# Altium project S6.PrjPCB
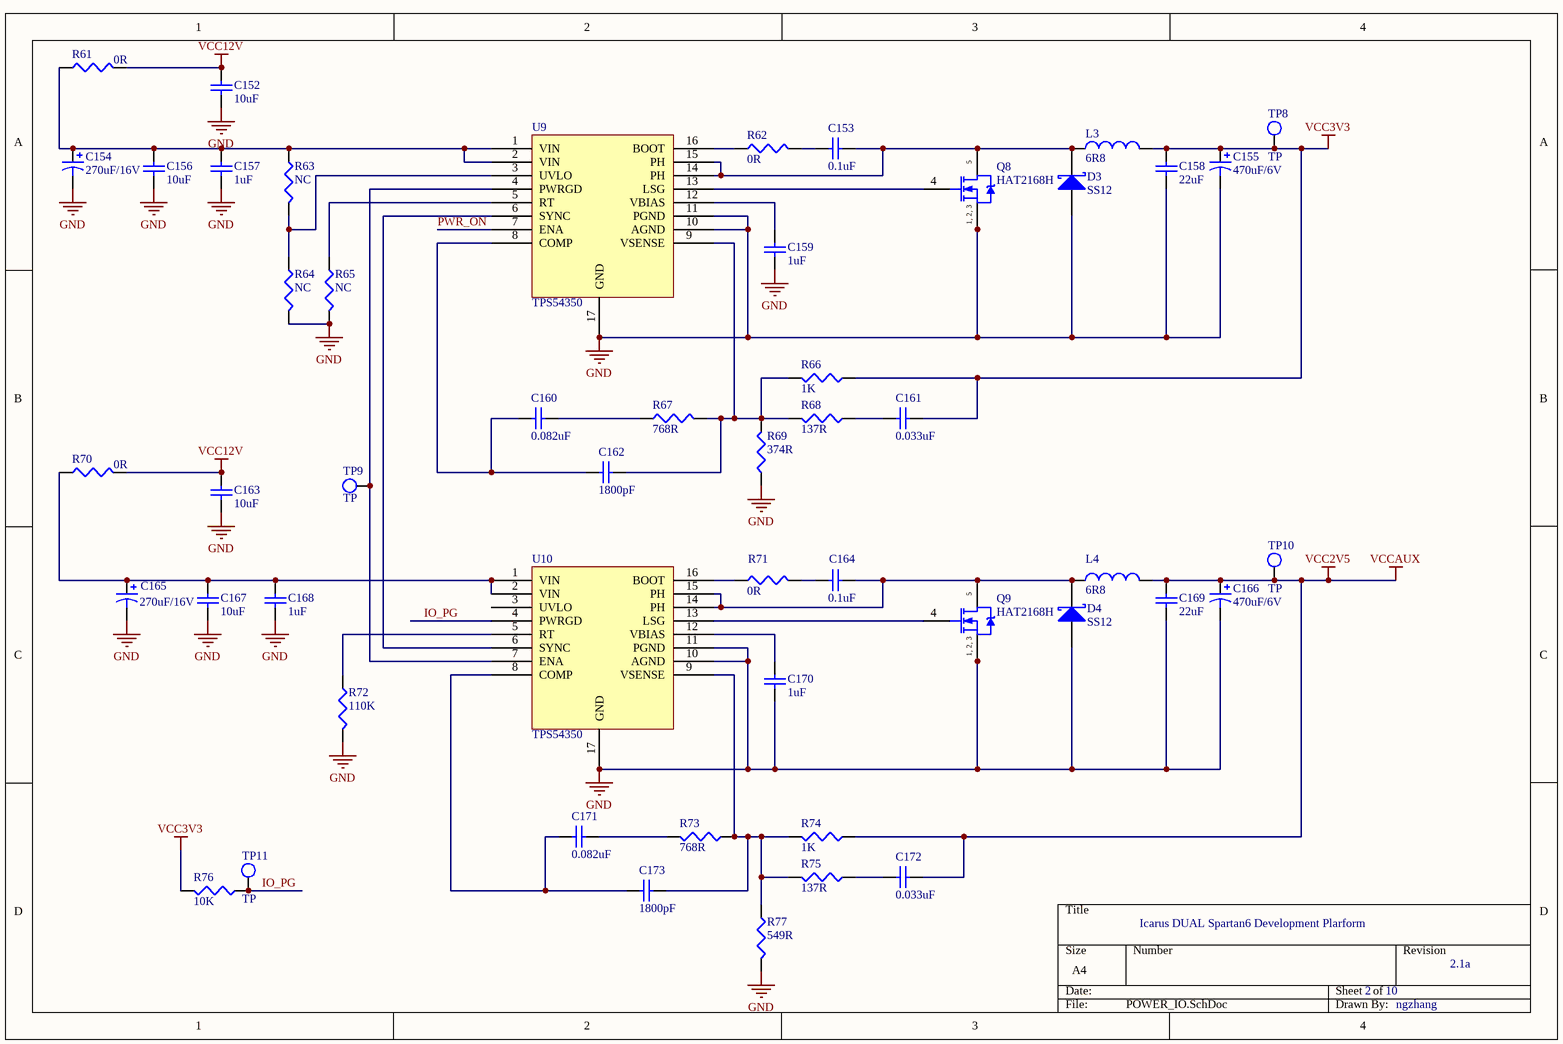
[diagram p0: POWER_IO.SchDoc]
4 sheets, 190 parts. Net scope: global (net labels, ports and power ports of the same name join across sheets).
Board file: S6.PcbDoc
Sheets:
  POWER_IO.SchDoc
  POWER.SchDoc
  USB2UART.SchDoc
  CONFIG.SchDoc

## Sheet POWER_IO.SchDoc
size A4

### Parts
C152  10uF  [C1206]
C153  0.1uF  [1608[0603]]
C154  270uF/16V  [CAP8X8]
C155  470uF/6V  [CAP8X8]
C156  10uF  [C1206]
C157  1uF  [1608[0603]]
C158  22uF  [C1206]
C159  1uF  [1608[0603]]
C160  0.082uF  [1608[0603]]
C161  0.033uF  [1608[0603]]
C162  1800pF  [1608[0603]]
C163  10uF  [C1206]
C164  0.1uF  [1608[0603]]
C165  270uF/16V  [CAP8X8]
C166  470uF/6V  [CAP8X8]
C167  10uF  [C1206]
C168  1uF  [1608[0603]]
C169  22uF  [C1206]
C170  1uF  [1608[0603]]
C171  0.082uF  [1608[0603]]
C172  0.033uF  [1608[0603]]
C173  1800pF  [1608[0603]]
D3  SS12  [SMA]
D4  SS12  [SMA]
L3  value 6R8  [IHLP4040]  (hidden comment: IHLP4040DZ11)
L4  value 6R8  [IHLP4040]  (hidden comment: IHLP4040DZ11)
Q8  HAT2168H  [LFPAK]
Q9  HAT2168H  [LFPAK]
R61  0R  [C1206]
R62  0R  [J1-0603]
R63  NC  [J1-0603]
R64  NC  [J1-0603]
R65  NC  [J1-0603]
R66  1K  [J1-0603]
R67  768R  [J1-0603]
R68  137R  [J1-0603]
R69  374R  [J1-0603]
R70  0R  [C1206]
R71  0R  [J1-0603]
R72  110K  [J1-0603]
R73  768R  [J1-0603]
R74  1K  [J1-0603]
R75  137R  [J1-0603]
R76  10K  [J1-0603]
R77  549R  [J1-0603]
TP8  TP  [TP]
TP9  TP  [TP]
TP10  TP  [TP]
TP11  TP  [TP]
U9  TPS54350  [TSSOP16_PP]
U10  TPS54350  [TSSOP16_PP]

### Nets
GND: C152.1 C154.2 C155.2 C156.1 C157.1 C158.1 C159.1 C163.1 C165.2 C166.2 C167.1 C168.1 C169.1 C170.2 D3.1(A) D4.1(A) Q8.1(S) Q8.2(S) Q8.3(S) Q9.1(S) Q9.2(S) Q9.3(S) R64.2 R65.2 R69.1 R72.2 R77.2 U9.10(AGND) U9.11(PGND) U9.17(GND) U10.10(AGND) U10.11(PGND) U10.17(GND)
VCC2V5: C166.1 C169.2 C172.2 L4.2 R74.1 TP10.1(TP)  [also labelled VCCAUX]  [project net VREF]
VCC3V3: C155.1 C158.2 C161.2 L3.2 R66.1 R76.2 TP8.1(TP)
VCC12V: C152.2 C163.2 R61.2 R70.2
IO_PG: R76.1 TP11.1(TP) U10.4(PWRGD)
PWR_ON: U9.7(ENA)
NetC153_1: C153.1 R62.2
NetC153_2: C153.2 D3.2(K) L3.1 Q8.5(D) U9.14(PH) U9.15(PH)
NetC154_1: C154.1 C156.2 C157.2 R61.1 R63.1 U9.1(VIN) U9.2(VIN)
NetC159_2: C159.2 U9.12(VBIAS)
NetC160_1: C160.1 C162.1 U9.8(COMP)
NetC160_2: C160.2 R67.1
NetC161_1: C161.1 R68.1
NetC162_2: C162.2 R66.2 R67.2 R68.2 R69.2 U9.9(VSENSE)
NetC164_1: C164.1 D4.2(K) L4.1 Q9.5(D) U10.14(PH) U10.15(PH)
NetC164_2: C164.2 R71.2
NetC165_1: C165.1 C167.2 C168.2 R70.1 U10.1(VIN) U10.2(VIN)
NetC170_1: C170.1 U10.12(VBIAS)
NetC171_1: C171.1 C173.1 U10.8(COMP)
NetC171_2: C171.2 R73.2
NetC172_1: C172.1 R75.1
NetC173_2: C173.2 R73.1 R74.2 R75.2 R77.1 U10.9(VSENSE)
NetQ8_4: Q8.4(G) U9.13(LSG)
NetQ9_4: Q9.4(G) U10.13(LSG)
NetR62_1: R62.1 U9.16(BOOT)
NetR63_2: R63.2 R64.1 U9.3(UVLO)
NetR65_1: R65.1 U9.5(RT)
NetR71_1: R71.1 U10.16(BOOT)
NetR72_1: R72.1 U10.5(RT)
NetTP9_1: TP9.1(TP) U9.4(PWRGD) U10.7(ENA)
NetU9_6: U9.6(SYNC) U10.6(SYNC)

Not connected (* = marked no-connect by the designer): U10 3(UVLO)

### Notes on the sheet
- Icarus DUAL Spartan6 Development Plarform
- 2
- 10
- 2.1a
- ngzhang
- (in symbol HAT216X) 1, 2, 3

### Library data of the parts
C152 C153 C156-C164 C167-C173 = Cap Semi: Capacitor (Semiconductor SIM Model); Published: 8-Jun-2000; LatestRevisionDate: 29-May-2009; LatestRevisionNote: IPC-7351 Footprint Added.; PackageReference: C1206; Publisher: Altium Limited; PackageDescription: Chip Capacitor
  C152 C156 C163 C167: Value: 10uF
  C153 C164: Value: 0.1uF
  C157 C159 C168 C170: Value: 1uF
  C158 C169: Value: 22uF
  C160 C171: Value: 0.082uF
  C161 C172: Value: 0.033uF
  C162 C173: Value: 1800pF
C154 C155 C165 C166 = Cap Pol3: Polarized Capacitor (Surface Mount); Published: 8-Jun-2000; LatestRevisionDate: 29-May-2009; LatestRevisionNote: IPC-7351 Footprint Added.; PackageReference: C0805; Publisher: Altium Limited; PackageDescription: Chip Capacitor
  C154 C165: Value: 270uF/16V
  C155 C166: Value: 470uF/6V
D3 D4 = 10MQ060N: Schottky Rectifier; Published: 17-Sep-2003; DatasheetVersion: May-2002; PackageVersion: revH, May-2002; PackageReference: SMA; Publisher: Altium Limited; PackageDescription: DO-214-AC/SMA; 2 C-Bend Leads; Body 5 x 2.7 mm, inc. leads (LxW); ComponentLink1Description: Manufacturer Link; ComponentLink1URL: http://www.irf.com/; ComponentLink2Description: Datasheet; ComponentLink2URL: http://www.irf.com/product-info/datasheets/data/10MQ060N.pdf
L3 L4 = Inductor: Code_IEC: 1005; Published: 8-Jun-2000; LatestRevisionDate: 29-May-2009; LatestRevisionNote: IPC-7351 Footprint Added.; PackageReference: 0402-A; Publisher: Altium Limited; PackageDescription: Chip Inductor; Code_JEITA: 0402
Q8 Q9 = HAT216X
R61-R77 = Res3: Resistor; Published: 8-Jun-2000; LatestRevisionDate: 29-May-2009; LatestRevisionNote: IPC-7351 Footprint Added.; PackageReference: J1-0603; Publisher: Altium Limited; PackageDescription: Chip Resistor
  R61 R62 R70 R71: Value: 0R
  R63-R65: Value: NC
  R66 R74: Value: 1K
  R67 R73: Value: 768R
  R68 R75: Value: 137R
  R69: Value: 374R
  R72: Value: 110K
  R76: Value: 10K
  R77: Value: 549R

## Sheet POWER.SchDoc
size A3
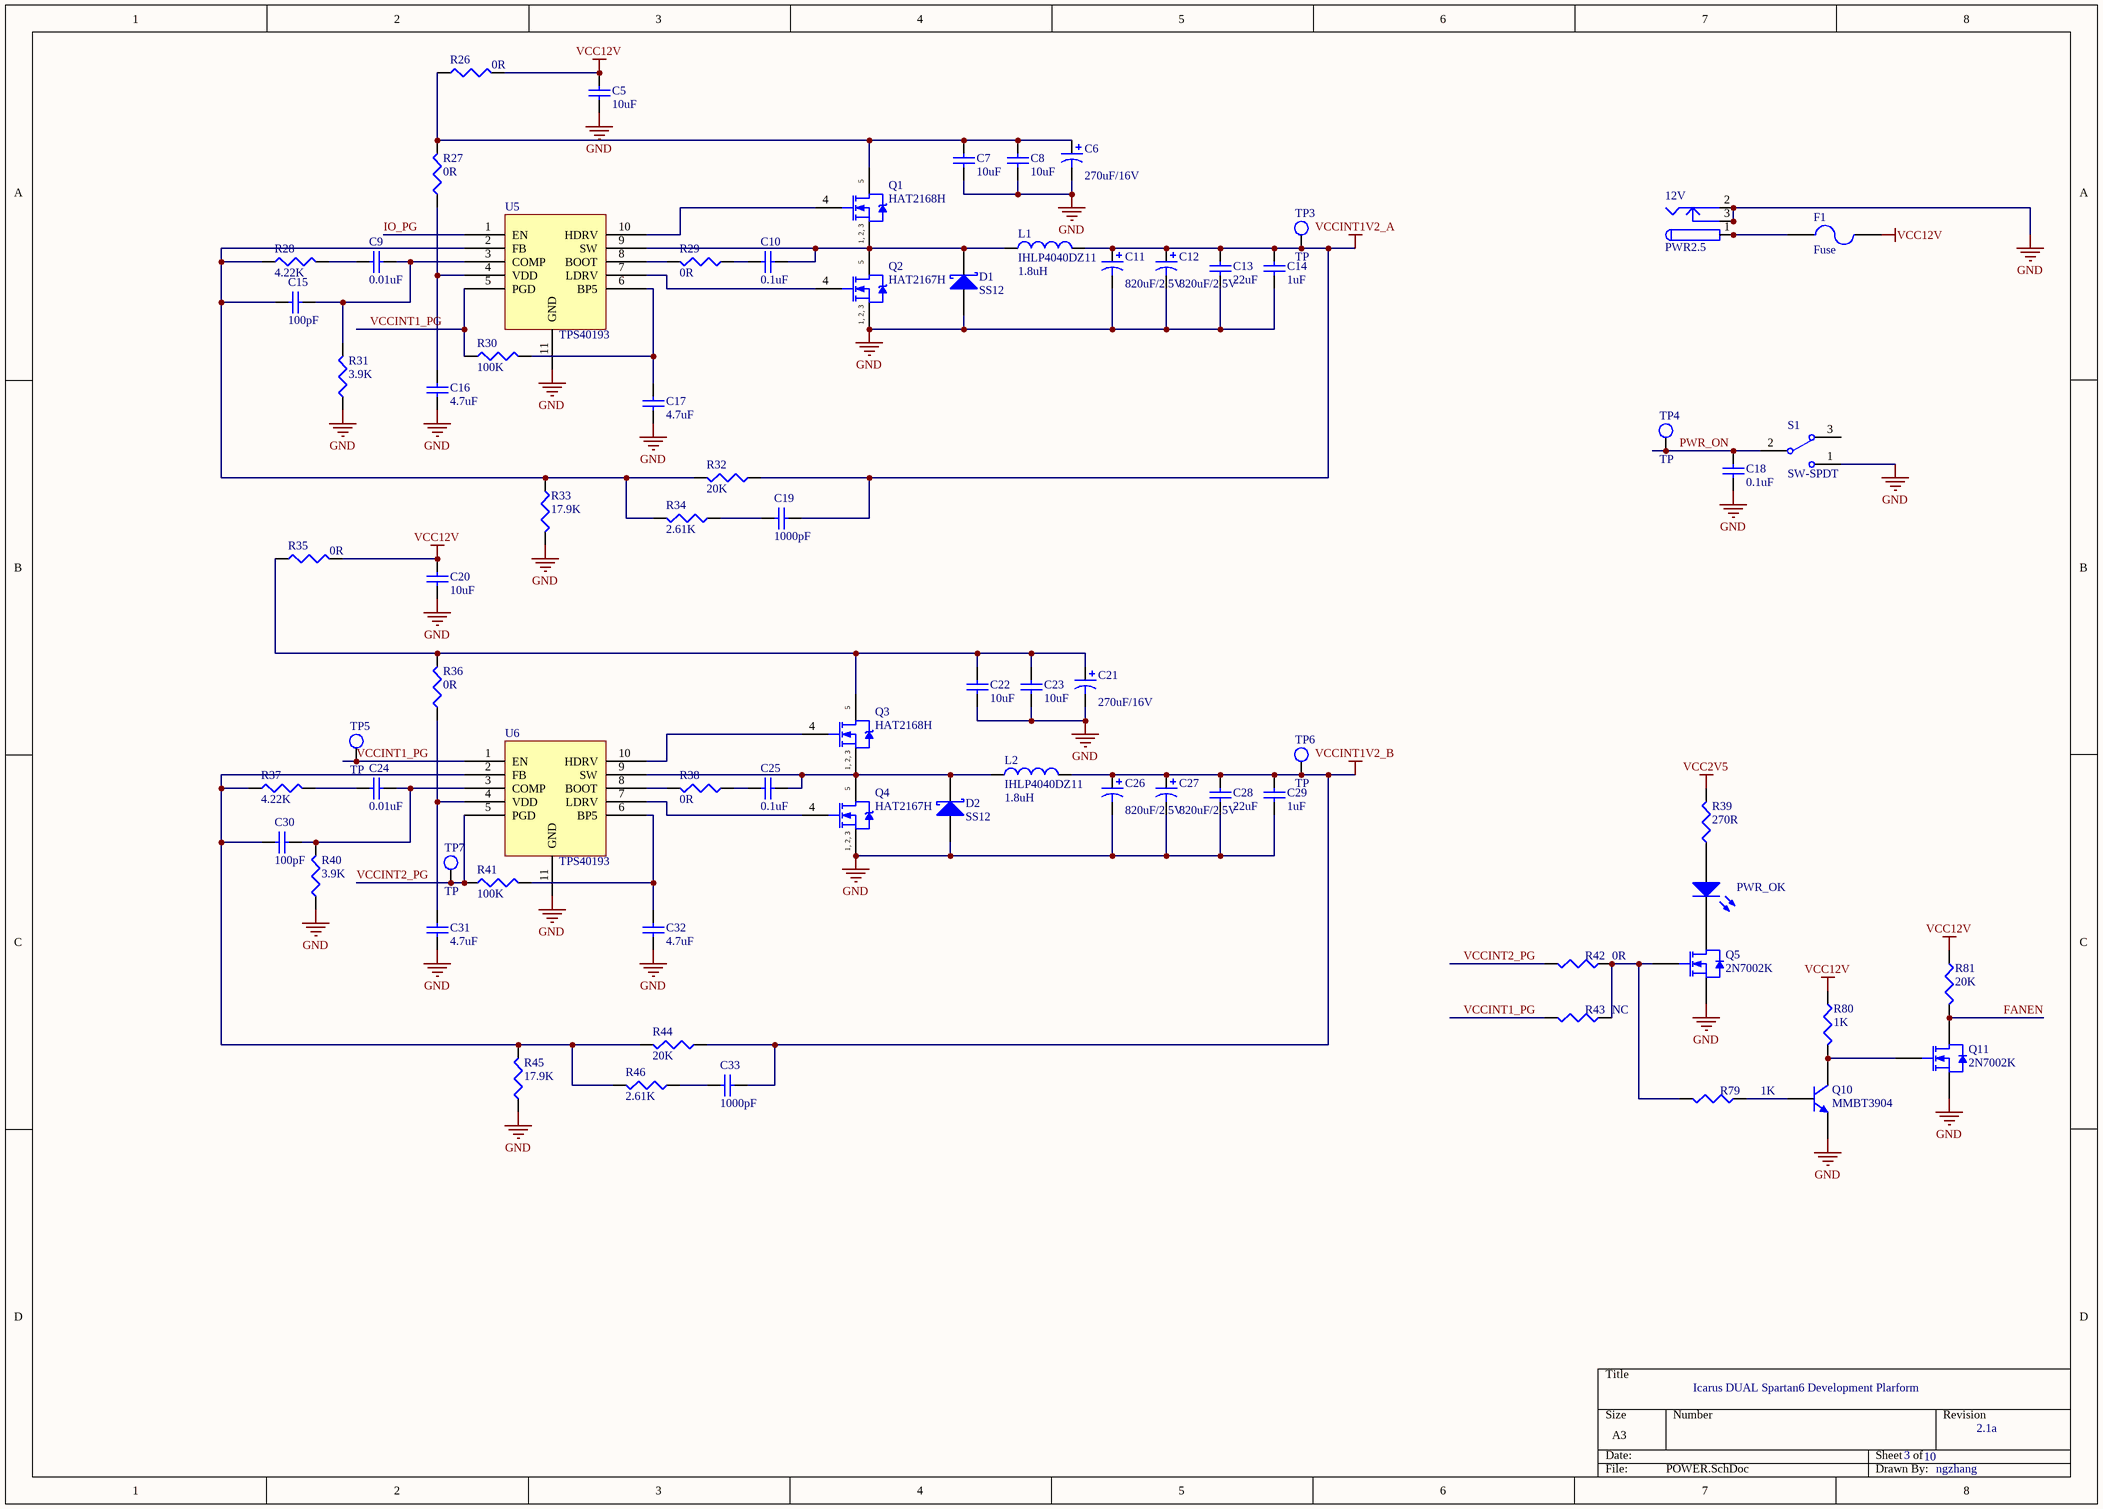
[diagram p1: POWER.SchDoc]

### Parts
12V  PWR2.5  [KLD-0202]
C5  10uF  [C1206]
C6  270uF/16V  [CAP8X8]
C7  10uF  [C1206]
C8  10uF  [C1206]
C9  0.01uF  [1608[0603]]
C10  0.1uF  [1608[0603]]
C11  820uF/2.5V  [CAP8X8]
C12  820uF/2.5V  [CAP8X8]
C13  22uF  [C1206]
C14  1uF  [1608[0603]]
C15  100pF  [1608[0603]]
C16  4.7uF  [C0805]
C17  4.7uF  [C0805]
C18  0.1uF  [1608[0603]]
C19  1000pF  [1608[0603]]
C20  10uF  [C1206]
C21  270uF/16V  [CAP8X8]
C22  10uF  [C1206]
C23  10uF  [C1206]
C24  0.01uF  [1608[0603]]
C25  0.1uF  [1608[0603]]
C26  820uF/2.5V  [CAP8X8]
C27  820uF/2.5V  [CAP8X8]
C28  22uF  [C1206]
C29  1uF  [1608[0603]]
C30  100pF  [1608[0603]]
C31  4.7uF  [C0805]
C32  4.7uF  [C0805]
C33  1000pF  [1608[0603]]
D1  SS12  [SMA]
D2  SS12  [SMA]
F1  Fuse  [12Z-2010]
L1  IHLP4040DZ11  value 1.8uH  [IHLP4040]
L2  IHLP4040DZ11  value 1.8uH  [IHLP4040]
PWR_OK  LED3  [CD1608-0603]  (value not drawn)
Q1  HAT2168H  [LFPAK]
Q2  HAT2167H  [LFPAK]
Q3  HAT2168H  [LFPAK]
Q4  HAT2167H  [LFPAK]
Q5  2N7002K  [SOT23_N]
Q10  MMBT3904  [SOT23_N]
Q11  2N7002K  [SOT23_N]
R26  0R  [C1206]
R27  0R  [J1-0603]
R28  4.22K  [J1-0603]
R29  0R  [J1-0603]
R30  100K  [J1-0603]
R31  3.9K  [J1-0603]
R32  20K  [J1-0603]
R33  17.9K  [J1-0603]
R34  2.61K  [J1-0603]
R35  0R  [C1206]
R36  0R  [J1-0603]
R37  4.22K  [J1-0603]
R38  0R  [J1-0603]
R39  270R  [J1-0603]
R40  3.9K  [J1-0603]
R41  100K  [J1-0603]
R42  0R  [J1-0603]
R43  NC  [J1-0603]
R44  20K  [J1-0603]
R45  17.9K  [J1-0603]
R46  2.61K  [J1-0603]
R79  1K  [J1-0603]
R80  1K  [J1-0603]
R81  20K  [J1-0603]
S1  SW-SPDT  [SW_3]
TP3  TP  [TP]
TP4  TP  [TP]
TP5  TP  [TP]
TP6  TP  [TP]
TP7  TP  [TP]
U5  TPS40193  [SON10]
U6  TPS40193  [SON10]

### Nets
GND: 12V.2 12V.2A 12V.2B 12V.3 12V.3A 12V.3B C5.1 C6.2 C7.1 C8.1 C11.2 C12.2 C13.1 C14.1 C16.2 C17.1 C18.1 C20.1 C21.2 C22.1 C23.1 C26.2 C27.2 C28.1 C29.1 C31.1 C32.2 D1.1(A) D2.1(A) Q2.1(S) Q2.2(S) Q2.3(S) Q4.1(S) Q4.2(S) Q4.3(S) Q5.2(S) Q10.2(E) Q11.2(S) R31.1 R33.2 R40.1 R45.1 S1.1 U5.11(GND) U6.11(GND)
VCC2V5: R39.2  [project net VREF]
VCC12V: C5.2 C20.2 F1.2 R26.2 R35.2 R80.1 R81.1
VCCINT1V2_A: C11.1 C12.1 C13.2 C14.2 C19.2 L1.2 R32.1 TP3.1(TP)
VCCINT1V2_B: C26.1 C27.1 C28.2 C29.2 C33.2 L2.2 R44.1 TP6.1(TP)
FANEN: Q11.3(D) R81.2
IO_PG: U5.1(EN)
PWR_ON: C18.2 S1.2 TP4.1(TP)
VCCINT1_PG: R30.1 R43.2 TP5.1(TP) U5.5(PGD) U6.1(EN)
VCCINT2_PG: R41.1 R42.2 TP7.1(TP) U6.5(PGD)
Net12V_1: 12V.1 12V.1A 12V.1B F1.1
NetC6_1: C6.1 C7.2 C8.2 Q1.5(D) R26.1 R27.2
NetC9_1: C9.1 C15.1 R31.2 U5.3(COMP)
NetC9_2: C9.2 R28.2
NetC10_1: C10.1 D1.2(K) L1.1 Q1.1(S) Q1.2(S) Q1.3(S) Q2.5(D) U5.9(SW)
NetC10_2: C10.2 R29.1
NetC15_2: C15.2 R28.1 R32.2 R33.1 R34.2 U5.2(FB)
NetC16_1: C16.1 R27.1 U5.4(VDD)
NetC17_2: C17.2 R30.2 U5.6(BP5)
NetC19_1: C19.1 R34.1
NetC21_1: C21.1 C22.2 C23.2 Q3.5(D) R35.1 R36.2
NetC24_1: C24.1 C30.1 R40.2 U6.3(COMP)
NetC24_2: C24.2 R37.2
NetC25_1: C25.1 D2.2(K) L2.1 Q3.1(S) Q3.2(S) Q3.3(S) Q4.5(D) U6.9(SW)
NetC25_2: C25.2 R38.1
NetC30_2: C30.2 R37.1 R44.2 R45.2 R46.2 U6.2(FB)
NetC31_2: C31.2 R36.1 U6.4(VDD)
NetC32_1: C32.1 R41.2 U6.6(BP5)
NetC33_1: C33.1 R46.1
NetPWR_OK_1: PWR_OK.1(A) R39.1
NetPWR_OK_2: PWR_OK.2(K) Q5.3(D)
NetQ1_4: Q1.4(G) U5.10(HDRV)
NetQ2_4: Q2.4(G) U5.7(LDRV)
NetQ3_4: Q3.4(G) U6.10(HDRV)
NetQ4_4: Q4.4(G) U6.7(LDRV)
NetQ5_1: Q5.1(G) R42.1 R43.1 R79.2
NetQ10_1: Q10.1(B) R79.1
NetQ10_3: Q10.3(C) Q11.1(G) R80.2
NetR29_2: R29.2 U5.8(BOOT)
NetR38_2: R38.2 U6.8(BOOT)

Not connected (* = marked no-connect by the designer): S1 3

### Notes on the sheet
- Icarus DUAL Spartan6 Development Plarform
- 3
- 10
- 2.1a
- ngzhang
- (in symbol HAT216X) 1, 2, 3

### Library data of the parts
12V = PWR2.5: Low Voltage Power Supply Connector; Published: 17-Dec-2003; DatasheetDocument: 09-May-2002; Publisher: Altium Limited; ComponentLink1Description: Manufacturer Link; ComponentLink1URL: http://domino.kycon.com/internet/Products.html
C5 C7-C10 C13-C20 C22-C25 C28-C33 = Cap Semi: Capacitor (Semiconductor SIM Model); Published: 8-Jun-2000; LatestRevisionDate: 29-May-2009; LatestRevisionNote: IPC-7351 Footprint Added.; PackageReference: C1206; Publisher: Altium Limited; PackageDescription: Chip Capacitor
  C5 C7 C8 C20 C22 C23: Value: 10uF
  C9 C24: Value: 0.01uF
  C10 C18 C25: Value: 0.1uF
  C13 C28: Value: 22uF
  C14 C29: Value: 1uF
  C15 C30: Value: 100pF
  C16 C17 C31 C32: Value: 4.7uF
  C19 C33: Value: 1000pF
C6 C11 C12 C21 C26 C27 = Cap Pol1: Polarized Capacitor (Radial); Published: 8-Jun-2000; LatestRevisionDate: 17-Jul-2002; LatestRevisionNote: Re-released for DXP Platform.; PackageReference: RB7.6-15; Publisher: Altium Limited; PackageDescription: Polarized Capacitor (Radial); 2 Leads
  C6 C21: Value: 270uF/16V
  C11 C12 C26 C27: Value: 820uF/2.5V
D1 D2 = 10MQ060N: Schottky Rectifier; Published: 17-Sep-2003; DatasheetVersion: May-2002; PackageVersion: revH, May-2002; PackageReference: SMA; Publisher: Altium Limited; PackageDescription: DO-214-AC/SMA; 2 C-Bend Leads; Body 5 x 2.7 mm, inc. leads (LxW); ComponentLink1Description: Manufacturer Link; ComponentLink1URL: http://www.irf.com/; ComponentLink2Description: Datasheet; ComponentLink2URL: http://www.irf.com/product-info/datasheets/data/10MQ060N.pdf
F1 = Fuse 2: Published: 8-Jun-2000; LatestRevisionDate: 17-Jul-2002; LatestRevisionNote: Re-released for DXP Platform.; PackageReference: PIN-W2/E2.8; Publisher: Altium Limited
L1 L2 = Inductor: Code_IEC: 1005; Published: 8-Jun-2000; LatestRevisionDate: 29-May-2009; LatestRevisionNote: IPC-7351 Footprint Added.; PackageReference: 0402-A; Publisher: Altium Limited; PackageDescription: Chip Inductor; Code_JEITA: 0402
PWR_OK = LED3: Typical BLUE SiC LED; Published: 8-Jun-2000; LatestRevisionDate: 17-Dec-2003; LatestRevisionNote: PCB Footprint replaced.; DatasheetVersion: 16-Apr-2002; PackageVersion: 16-Apr-2002; PackageReference: 3.5X2.8X1.9; Publisher: Altium Limited; PackageDescription: SM LED; 2 C-Bend Leads; Body 3.5 x 2.8 x 1.9 mm, inc leads (LxWxH typ)
Q1-Q4 = HAT216X
Q5 Q11 = 2N7002: N-channel Enhancement Mode Field-effect Transistor; Published: 17-Sep-2003; LatestRevisionDate: 12-Dec-2006; LatestRevisionNote: IPC-7351 Footprint Added.; DatasheetVersion: 27-Jul-2000; PackageVersion: May-1999; PackageReference: SOT23; Publisher: Altium Limited; PackageDescription: 3-Pin SOT-23 Package 0.95 mm Pitch, 2.3 mm Lead Span; ComponentLink1Description: Manufacturer Link; ComponentLink1URL: http://www.semiconductors.philips.com/; ComponentLink2Description: Datasheet; ComponentLink2URL: http://www.semiconductors.philips.com/acrobat/datasheets/2N7002_4.pdf
Q10 = MMBT3904: NPN Switching Transistor; Published: 17-Sep-2003; LatestRevisionDate: 12-Dec-2006; LatestRevisionNote: IPC-7351 Footprint Added.; DatasheetVersion: 13-May-2002; PackageVersion: May-1999; PackageReference: SOT23; Publisher: Altium Limited; PackageDescription: 3-Pin SOT-23 Package 0.95 mm Pitch, 2.3 mm Lead Span; ComponentLink1Description: Manufacturer Link; ComponentLink1URL: http://www.semiconductors.philips.com/; ComponentLink2Description: Datasheet; ComponentLink2URL: http://www.semiconductors.philips.com/acrobat/datasheets/MMBT3904_4.pdf
R26-R46 R79-R81 = Res3: Resistor; Published: 8-Jun-2000; LatestRevisionDate: 29-May-2009; LatestRevisionNote: IPC-7351 Footprint Added.; PackageReference: J1-0603; Publisher: Altium Limited; PackageDescription: Chip Resistor
  R26 R27 R29 R35 R36 R38 R42: Value: 0R
  R28 R37: Value: 4.22K
  R30 R41: Value: 100K
  R31 R40: Value: 3.9K
  R32 R44 R81: Value: 20K
  R33 R45: Value: 17.9K
  R34 R46: Value: 2.61K
  R39: Value: 270R
  R43: Value: NC
  R79 R80: Value: 1K
S1 = SW-SPDT: SPDT Subminiature Toggle Switch, Right Angle Mounting, Vertical Actuation; Published: 24-Mar-1999; LatestRevisionDate: 17-Dec-2003; LatestRevisionNote: Schematic revised, PCB Footprint replaced.; DatasheetVersion: 05-Dec-2000; PackageReference: TL36WW15050; Publisher: Altium Limited; PackageDescription: Switch; 4 Leads; ComponentLink1Description: Manufacturer Link; ComponentLink1URL: http://www.apem.com

## Sheet USB2UART.SchDoc
size A4
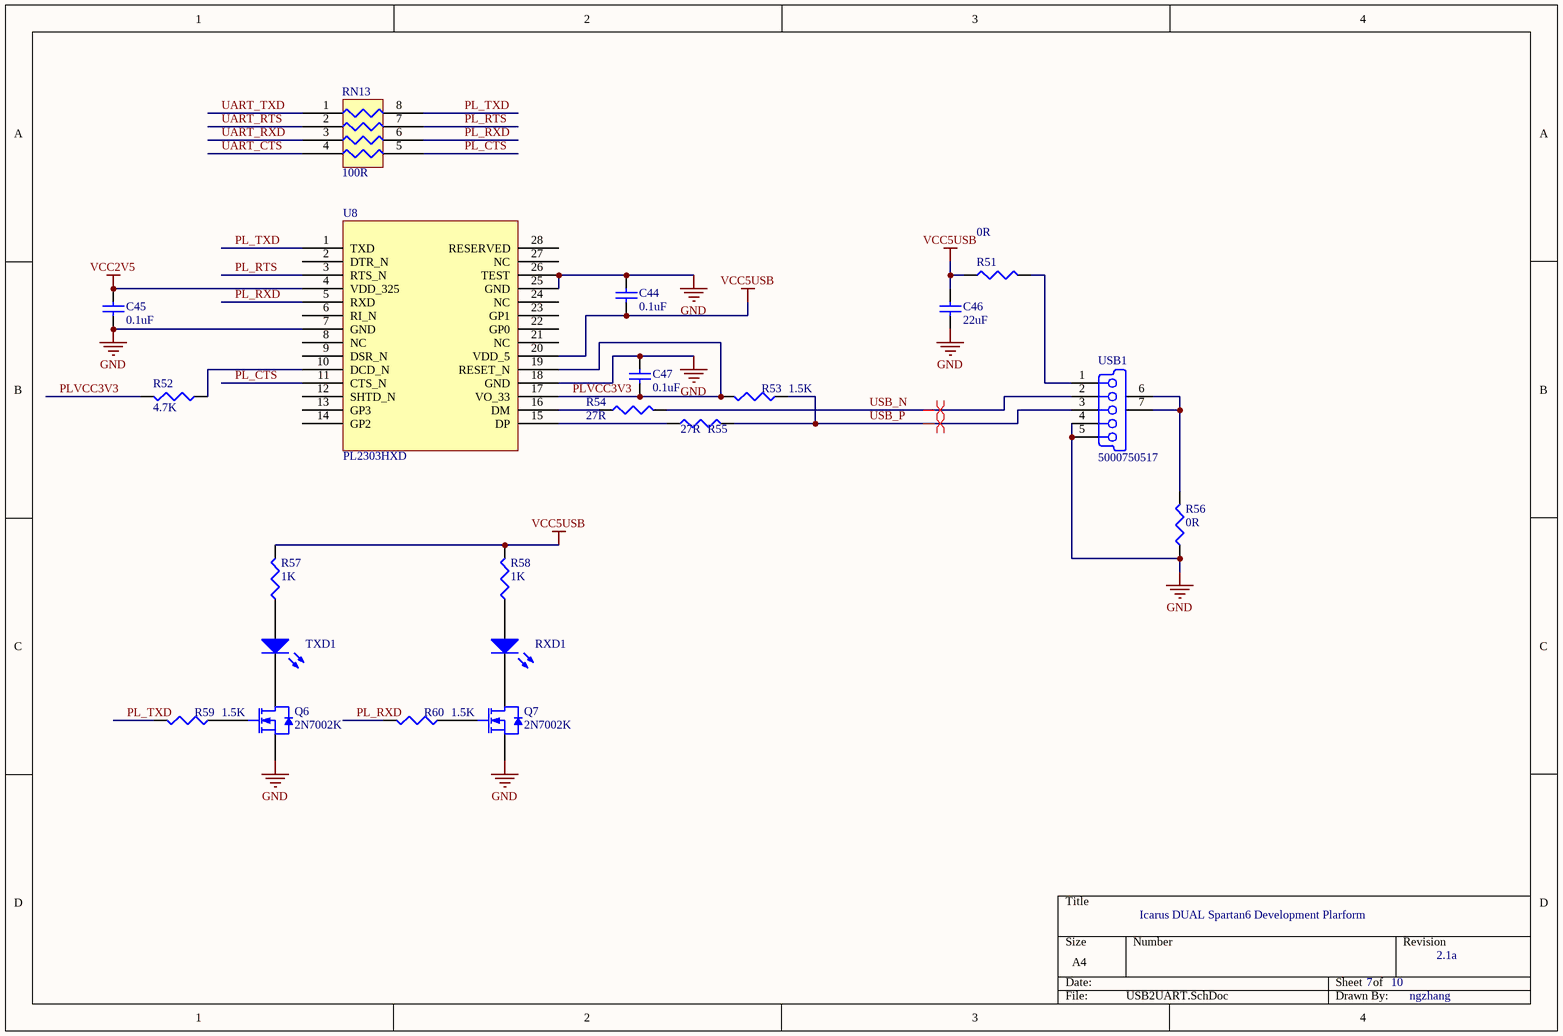
[diagram p2: USB2UART.SchDoc]

### Parts
C44  0.1uF  [1608[0603]]
C45  0.1uF  [1608[0603]]
C46  22uF  [C1206]
C47  0.1uF  [1608[0603]]
Q6  2N7002K  [SOT23_N]
Q7  2N7002K  [SOT23_N]
R51  0R  [J1-0603]
R52  4.7K  [J1-0603]
R53  1.5K  [J1-0603]
R54  27R  [J1-0603]
R55  27R  [J1-0603]
R56  0R  [J1-0603]
R57  1K  [J1-0603]
R58  1K  [J1-0603]
R59  1.5K  [J1-0603]
R60  1.5K  [J1-0603]
RN13  100R  [EXBV8V]
RXD1  LED3  [CD1608-0603]  (value not drawn)
TXD1  LED3  [CD1608-0603]  (value not drawn)
U8  PL2303HXD  [SSOP28_N]
USB1  5000750517  [5000750517]

### Nets
GND: C44.2 C45.1 C46.1 C47.2 Q6.2(S) Q7.2(S) R56.1 U8.7(GND) U8.18(GND) U8.25(GND) U8.26(TEST) USB1.4(ID) USB1.5(GND)
VCC2V5: C45.2 U8.4(VDD_325)  [project net VREF]
VCC5USB: C44.1 C46.2 R51.1 R57.2 R58.2 U8.20(VDD_5)
PL_CTS: RN13.5 U8.11(CTS_N)
PL_RTS: RN13.7 U8.3(RTS_N)
PL_RXD: R60.2 RN13.6 U8.5(RXD)
PL_TXD: R59.2 RN13.8 U8.1(TXD)
PLVCC3V3: C47.1 R52.2 R53.2 U8.17(VO_33) U8.19(RESET_N)
UART_CTS: RN13.4
UART_RTS: RN13.2
UART_RXD: RN13.3
UART_TXD: RN13.1
USB_N: R54.2 USB1.2(D-)
USB_P: R53.1 R55.2 USB1.3(D+)
NetQ6_1: Q6.1(G) R59.1
NetQ6_3: Q6.3(D) TXD1.2(K)
NetQ7_1: Q7.1(G) R60.1
NetQ7_3: Q7.3(D) RXD1.2(K)
NetR51_2: R51.2 USB1.1(V_BUS)
NetR52_1: R52.1 U8.10(DCD_N)
NetR54_1: R54.1 U8.16(DM)
NetR55_1: R55.1 U8.15(DP)
NetR56_2: R56.2 USB1.6(MH1) USB1.7(MH2)
NetR57_1: R57.1 TXD1.1(A)
NetR58_1: R58.1 RXD1.1(A)

Not connected (* = marked no-connect by the designer): U8 2(DTR_N) 6(RI_N) 8(NC) 9(DSR_N) 12(SHTD_N) 13(GP3) 14(GP2) 21(NC) 22(GP0) 23(GP1) 24(NC) 27(NC) 28(RESERVED)

### Layout directives
differential pair: USB_N, USB_P

### Notes on the sheet
- Icarus DUAL Spartan6 Development Plarform
- 7
- 10
- 2.1a
- ngzhang

### Library data of the parts
C44-C47 = Cap Semi: Capacitor (Semiconductor SIM Model); Published: 8-Jun-2000; LatestRevisionDate: 29-May-2009; LatestRevisionNote: IPC-7351 Footprint Added.; PackageReference: C1206; Publisher: Altium Limited; PackageDescription: Chip Capacitor
  C44 C45 C47: Value: 0.1uF
  C46: Value: 22uF
Q6 Q7 = 2N7002: as Q5 on sheet POWER; Published: 17-Sep-2003; LatestRevisionDate: 12-Dec-2006; LatestRevisionNote: IPC-7351 Footprint Added.; DatasheetVersion: 27-Jul-2000; PackageVersion: May-1999; PackageReference: SOT23; Publisher: Altium Limited; PackageDescription: 3-Pin SOT-23 Package 0.95 mm Pitch, 2.3 mm Lead Span; ComponentLink1Description: Manufacturer Link; ComponentLink1URL: http://www.semiconductors.philips.com/; ComponentLink2Description: Datasheet; ComponentLink2URL: http://www.semiconductors.philips.com/acrobat/datasheets/2N7002_4.pdf
R51-R60 = Res3: Resistor; Published: 8-Jun-2000; LatestRevisionDate: 29-May-2009; LatestRevisionNote: IPC-7351 Footprint Added.; PackageReference: J1-0603; Publisher: Altium Limited; PackageDescription: Chip Resistor
  R51 R56: Value: 0R
  R52: Value: 4.7K
  R53 R59 R60: Value: 1.5K
  R54 R55: Value: 27R
  R57 R58: Value: 1K
RN13 = RES4PACK
RXD1 TXD1 = LED3: Typical BLUE SiC LED; Published: 8-Jun-2000; LatestRevisionDate: 17-Dec-2003; LatestRevisionNote: PCB Footprint replaced.; DatasheetVersion: 16-Apr-2002; PackageVersion: 16-Apr-2002; PackageReference: 3.5X2.8X1.9; Publisher: Altium Limited; PackageDescription: SM LED; 2 C-Bend Leads; Body 3.5 x 2.8 x 1.9 mm, inc leads (LxWxH typ)
U8 = PL2303
USB1 = 5000750517: USB On-The-Go (OTG) Mini-B Receptacle, Right Angle, Thru-Hole, 0.80mm (.031") Pitch, Solder Tails & Shell Tabs with Dimples; PCB_Layout: Complies with Manufacturer's Recommendation.; Published: 30-May-2008; DatasheetVersion: rev0, Mar-2004; PackageVersion: rev0, Mar-2004; PackageReference: 5000750517; Publisher: Altium Limited; PackageDescription: USB Mini-B, Type 2, Thru-Hole; 5 Position; Vertical, Body 7.7 x 4.2 x 7.7 mm (LxWxH); ComponentLink1Description: Manufacturer Link; ComponentLink1URL: http://www.molex.com/; ComponentLink2Description: Datasheet; ComponentLink2URL: http://www.molex.com/pdm_docs/sd/5000750517_sd.pdf

## Sheet CONFIG.SchDoc
size A4
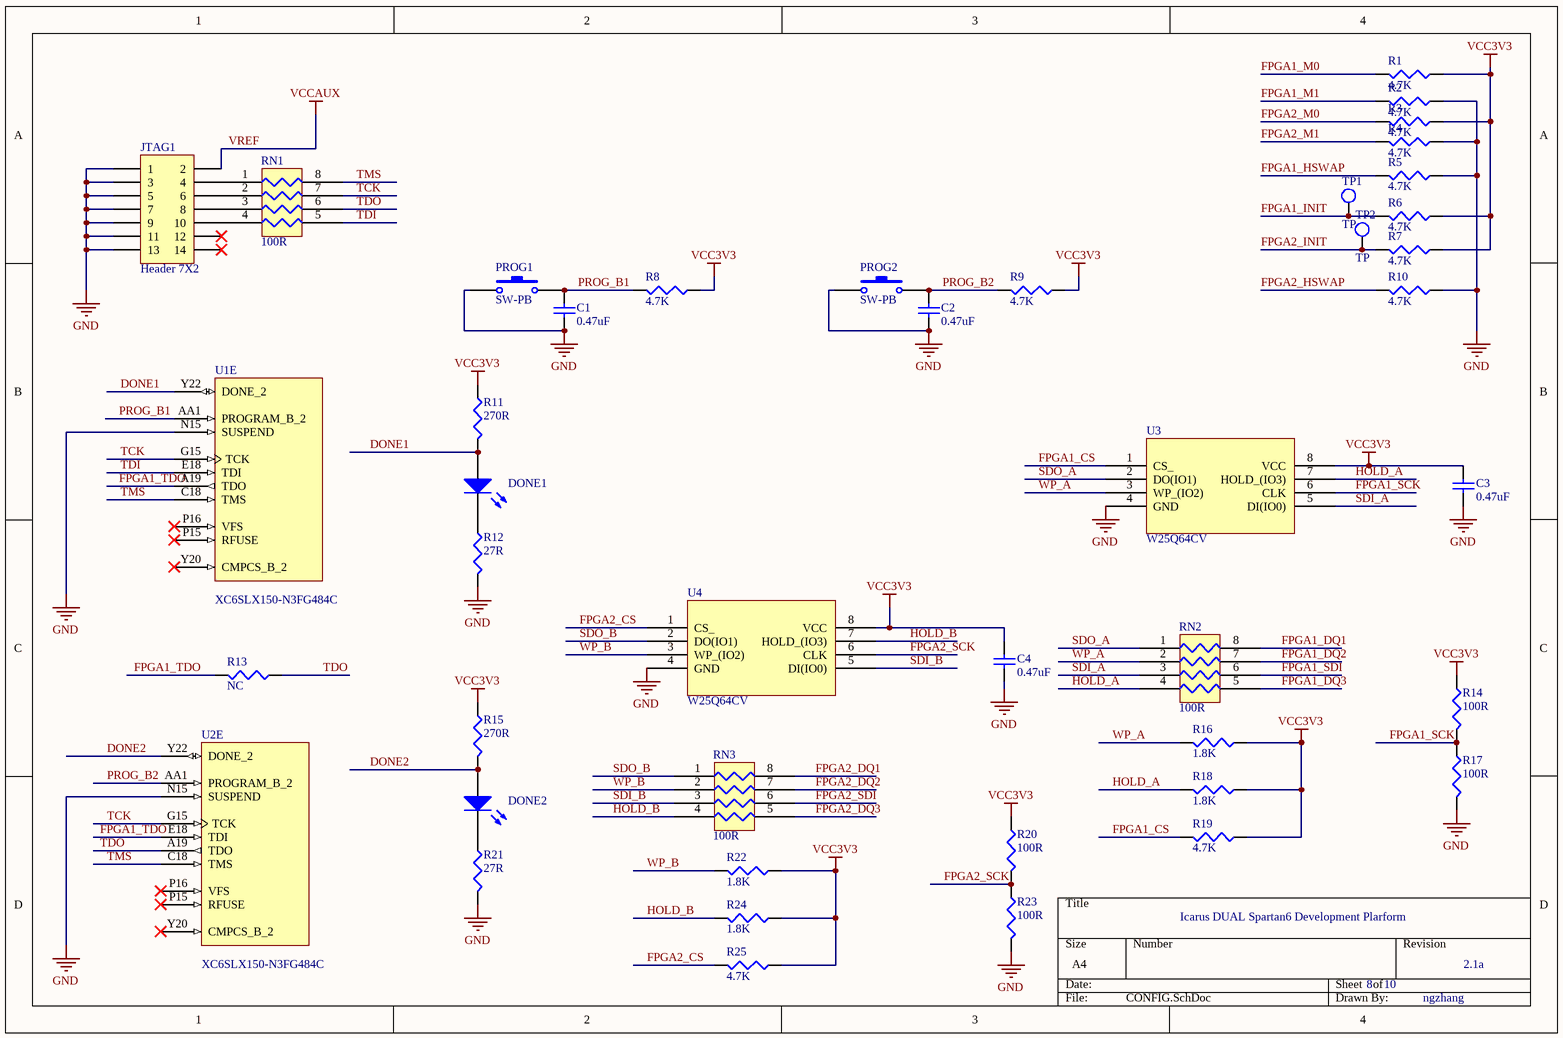
[diagram p3: CONFIG.SchDoc]

### Parts
C1  0.47uF  [0402]
C2  0.47uF  [0402]
C3  0.47uF  [0402]
C4  0.47uF  [0402]
DONE1  LED3  [CD1608-0603]  (value not drawn)
DONE2  LED3  [CD1608-0603]  (value not drawn)
JTAG1  Header 7X2  [MOLEX14P]
PROG1  SW-PB  [SW_2]
PROG2  SW-PB  [SW_2]
R1  4.7K  [0402]
R2  4.7K  [0402]
R3  4.7K  [0402]
R4  4.7K  [0402]
R5  4.7K  [0402]
R6  4.7K  [0402]
R7  4.7K  [0402]
R8  4.7K  [0402]
R9  4.7K  [0402]
R10  4.7K  [0402]
R11  270R  [0402]
R12  27R  [0402]
R13  NC  [0402]
R14  100R  [0402]
R15  270R  [0402]
R16  1.8K  [0402]
R17  100R  [0402]
R18  1.8K  [0402]
R19  4.7K  [0402]
R20  100R  [0402]
R21  27R  [0402]
R22  1.8K  [0402]
R23  100R  [0402]
R24  1.8K  [0402]
R25  4.7K  [0402]
RN1  100R  [EXBV8V]
RN2  100R  [EXBV8V]
RN3  100R  [EXBV8V]
TP1  TP  [TP]
TP2  TP  [TP]
U1  XC6SLX150-N3FG484C  [FG484]  (part E of 7)
U2  XC6SLX150-N3FG484C  [FG484]  (part E of 7)
U3  W25Q64CV  [WSON6X5]
U4  W25Q64CV  [WSON6X5]

### Nets
GND: C1.2 C2.2 C3.1 C4.1 JTAG1.1 JTAG1.3 JTAG1.5 JTAG1.7 JTAG1.9 JTAG1.11 JTAG1.13 PROG1.1 PROG2.1 R2.1 R4.1 R5.1 R10.1 R12.2 R17.2 R21.2 R23.2 U1.N15(SUSPEND) U2.N15(SUSPEND) U3.4(GND) U4.4(GND)
VCC3V3: C3.2 C4.2 R1.1 R3.1 R6.1 R7.1 R8.1 R9.1 R11.1 R14.1 R15.1 R16.1 R18.1 R19.1 R20.1 R22.1 R24.1 R25.1 U3.8(VCC) U4.8(VCC)
VREF: JTAG1.2  [also labelled VCCAUX]
DONE1: DONE1.1(A) R11.2 U1.Y22(DONE_2)
DONE2: DONE2.1(A) R15.2 U2.Y22(DONE_2)
FPGA1_CS: R19.2 U3.1(CS_)
FPGA1_DQ1: RN2.8
FPGA1_DQ2: RN2.7
FPGA1_DQ3: RN2.5
FPGA1_HSWAP: R5.2
FPGA1_INIT: R6.2 TP1.1(TP)
FPGA1_M0: R1.2
FPGA1_M1: R2.2
FPGA1_SCK: R14.2 R17.1 U3.6(CLK)
FPGA1_SDI: RN2.6
FPGA1_TDO: R13.2 U1.A19(TDO) U2.E18(TDI)
FPGA2_CS: R25.2 U4.1(CS_)
FPGA2_DQ1: RN3.8
FPGA2_DQ2: RN3.7
FPGA2_DQ3: RN3.5
FPGA2_HSWAP: R10.2
FPGA2_INIT: R7.2 TP2.1(TP)
FPGA2_M0: R3.2
FPGA2_M1: R4.2
FPGA2_SCK: R20.2 R23.1 U4.6(CLK)
FPGA2_SDI: RN3.6
HOLD_A: R18.2 RN2.4 U3.7(HOLD_(IO3))
HOLD_B: R24.2 RN3.4 U4.7(HOLD_(IO3))
PROG_B1: C1.1 PROG1.2 R8.2 U1.AA1(PROGRAM_B_2)
PROG_B2: C2.1 PROG2.2 R9.2 U2.AA1(PROGRAM_B_2)
SDI_A: RN2.3 U3.5(DI(IO0))
SDI_B: RN3.3 U4.5(DI(IO0))
SDO_A: RN2.1 U3.2(DO(IO1))
SDO_B: RN3.1 U4.2(DO(IO1))
TCK: RN1.7 U1.G15(TCK) U2.G15(TCK)
TDI: RN1.5 U1.E18(TDI)
TDO: R13.1 RN1.6 U2.A19(TDO)
TMS: RN1.8 U1.C18(TMS) U2.C18(TMS)
WP_A: R16.2 RN2.2 U3.3(WP_(IO2))
WP_B: R22.2 RN3.2 U4.3(WP_(IO2))
NetDONE1_2: DONE1.2(K) R12.1
NetDONE2_2: DONE2.2(K) R21.1
NetJTAG1_4: JTAG1.4 RN1.1
NetJTAG1_6: JTAG1.6 RN1.2
NetJTAG1_8: JTAG1.8 RN1.3
NetJTAG1_10: JTAG1.10 RN1.4

Not connected (* = marked no-connect by the designer): JTAG1 12* 14*; U1 P15(RFUSE)* P16(VFS)* Y20(CMPCS_B_2)*; U2 P15(RFUSE)* P16(VFS)* Y20(CMPCS_B_2)*

### Notes on the sheet
- Icarus DUAL Spartan6 Development Plarform
- 8
- 10
- 2.1a
- ngzhang

### Library data of the parts
C1-C4 = Cap Semi: Capacitor (Semiconductor SIM Model); Published: 8-Jun-2000; LatestRevisionDate: 29-May-2009; LatestRevisionNote: IPC-7351 Footprint Added.; PackageReference: C1206; Publisher: Altium Limited; PackageDescription: Chip Capacitor; Value: 0.47uF
DONE1 DONE2 = LED3: Typical BLUE SiC LED; Published: 8-Jun-2000; LatestRevisionDate: 17-Dec-2003; LatestRevisionNote: PCB Footprint replaced.; DatasheetVersion: 16-Apr-2002; PackageVersion: 16-Apr-2002; PackageReference: 3.5X2.8X1.9; Publisher: Altium Limited; PackageDescription: SM LED; 2 C-Bend Leads; Body 3.5 x 2.8 x 1.9 mm, inc leads (LxWxH typ)
JTAG1 = Header 7X2: Header, 7-Pin, Dual row; LatestRevisionDate: 17-Jul-2002; LatestRevisionNote: Re-released for DXP Platform.; Publisher: Altium Limited
PROG1 PROG2 = SW-PB: Switch; Published: 24-Mar-1999; LatestRevisionDate: 17-Jul-2002; LatestRevisionNote: Re-released for DXP Platform.; PackageReference: SPST-2; Publisher: Altium Limited; PackageDescription: Switch; 2 Leads
R1-R25 = Res3: Resistor; Published: 8-Jun-2000; LatestRevisionDate: 29-May-2009; LatestRevisionNote: IPC-7351 Footprint Added.; PackageReference: J1-0603; Publisher: Altium Limited; PackageDescription: Chip Resistor
  R1-R10 R19 R25: Value: 4.7K
  R11 R15: Value: 270R
  R12 R21: Value: 27R
  R13: Value: NC
  R14 R17 R20 R23: Value: 100R
  R16 R18 R22 R24: Value: 1.8K
RN1-RN3 = RES4PACK
U1 U2 = XC6SLX150-N3FG484C: Spartan-6 LX 1.2V FPGA, 338 User I/Os, 484-Ball Fine-Pitch BGA (1.0mm Pitch), Speed Grade 3N, Commercial Grade; Published: 24-Aug-2010; DatasheetVersion: ver1.6, Nov-2010; PackageVersion: ver1.1, Dec-2008; PackageReference: FG484; Publisher: Altium Limited; PackageDescription: 484-Ball Fine Pitch Ball Grid Array 1.00 mm Pitch (FG484); Code_JEDEC: MS-034-AAJ-1; Code_IPC: BGA100P22X22-484; ComponentLink1Description: Manufacturer Link; ComponentLink1URL: http://www.xilinx.com; ComponentLink2Description: Spartan-6 Datasheet; ComponentLink2URL: http://www.xilinx.com/support/documentation/data_sheets/ds160.pdf; ComponentLink3Description: Spartan-6 Documents; ComponentLink3URL: http://www.xilinx.com/support/documentation/spartan-6.htm; ComponentLink4Description: Xilinx.com Home; ComponentLink4URL: http://www.xilinx.com

## Nets that join several sheets
GND: POWER_IO (33 pins), POWER (45 pins), USB2UART (13 pins), CONFIG (25 pins)
VCC3V3: POWER_IO (7 pins), CONFIG (20 pins)
VCC12V: POWER_IO (C152.2 C163.2 R61.2 R70.2), POWER (7 pins)
VREF: POWER_IO (6 pins), POWER (R39.2), USB2UART (C45.2 U8.4), CONFIG (JTAG1.2)
IO_PG: POWER_IO (R76.1 TP11.1 U10.4), POWER (U5.1)
PWR_ON: POWER_IO (U9.7), POWER (C18.2 S1.2 TP4.1)